# EAGLE schematic Tally Board (EAGLE 6.2)
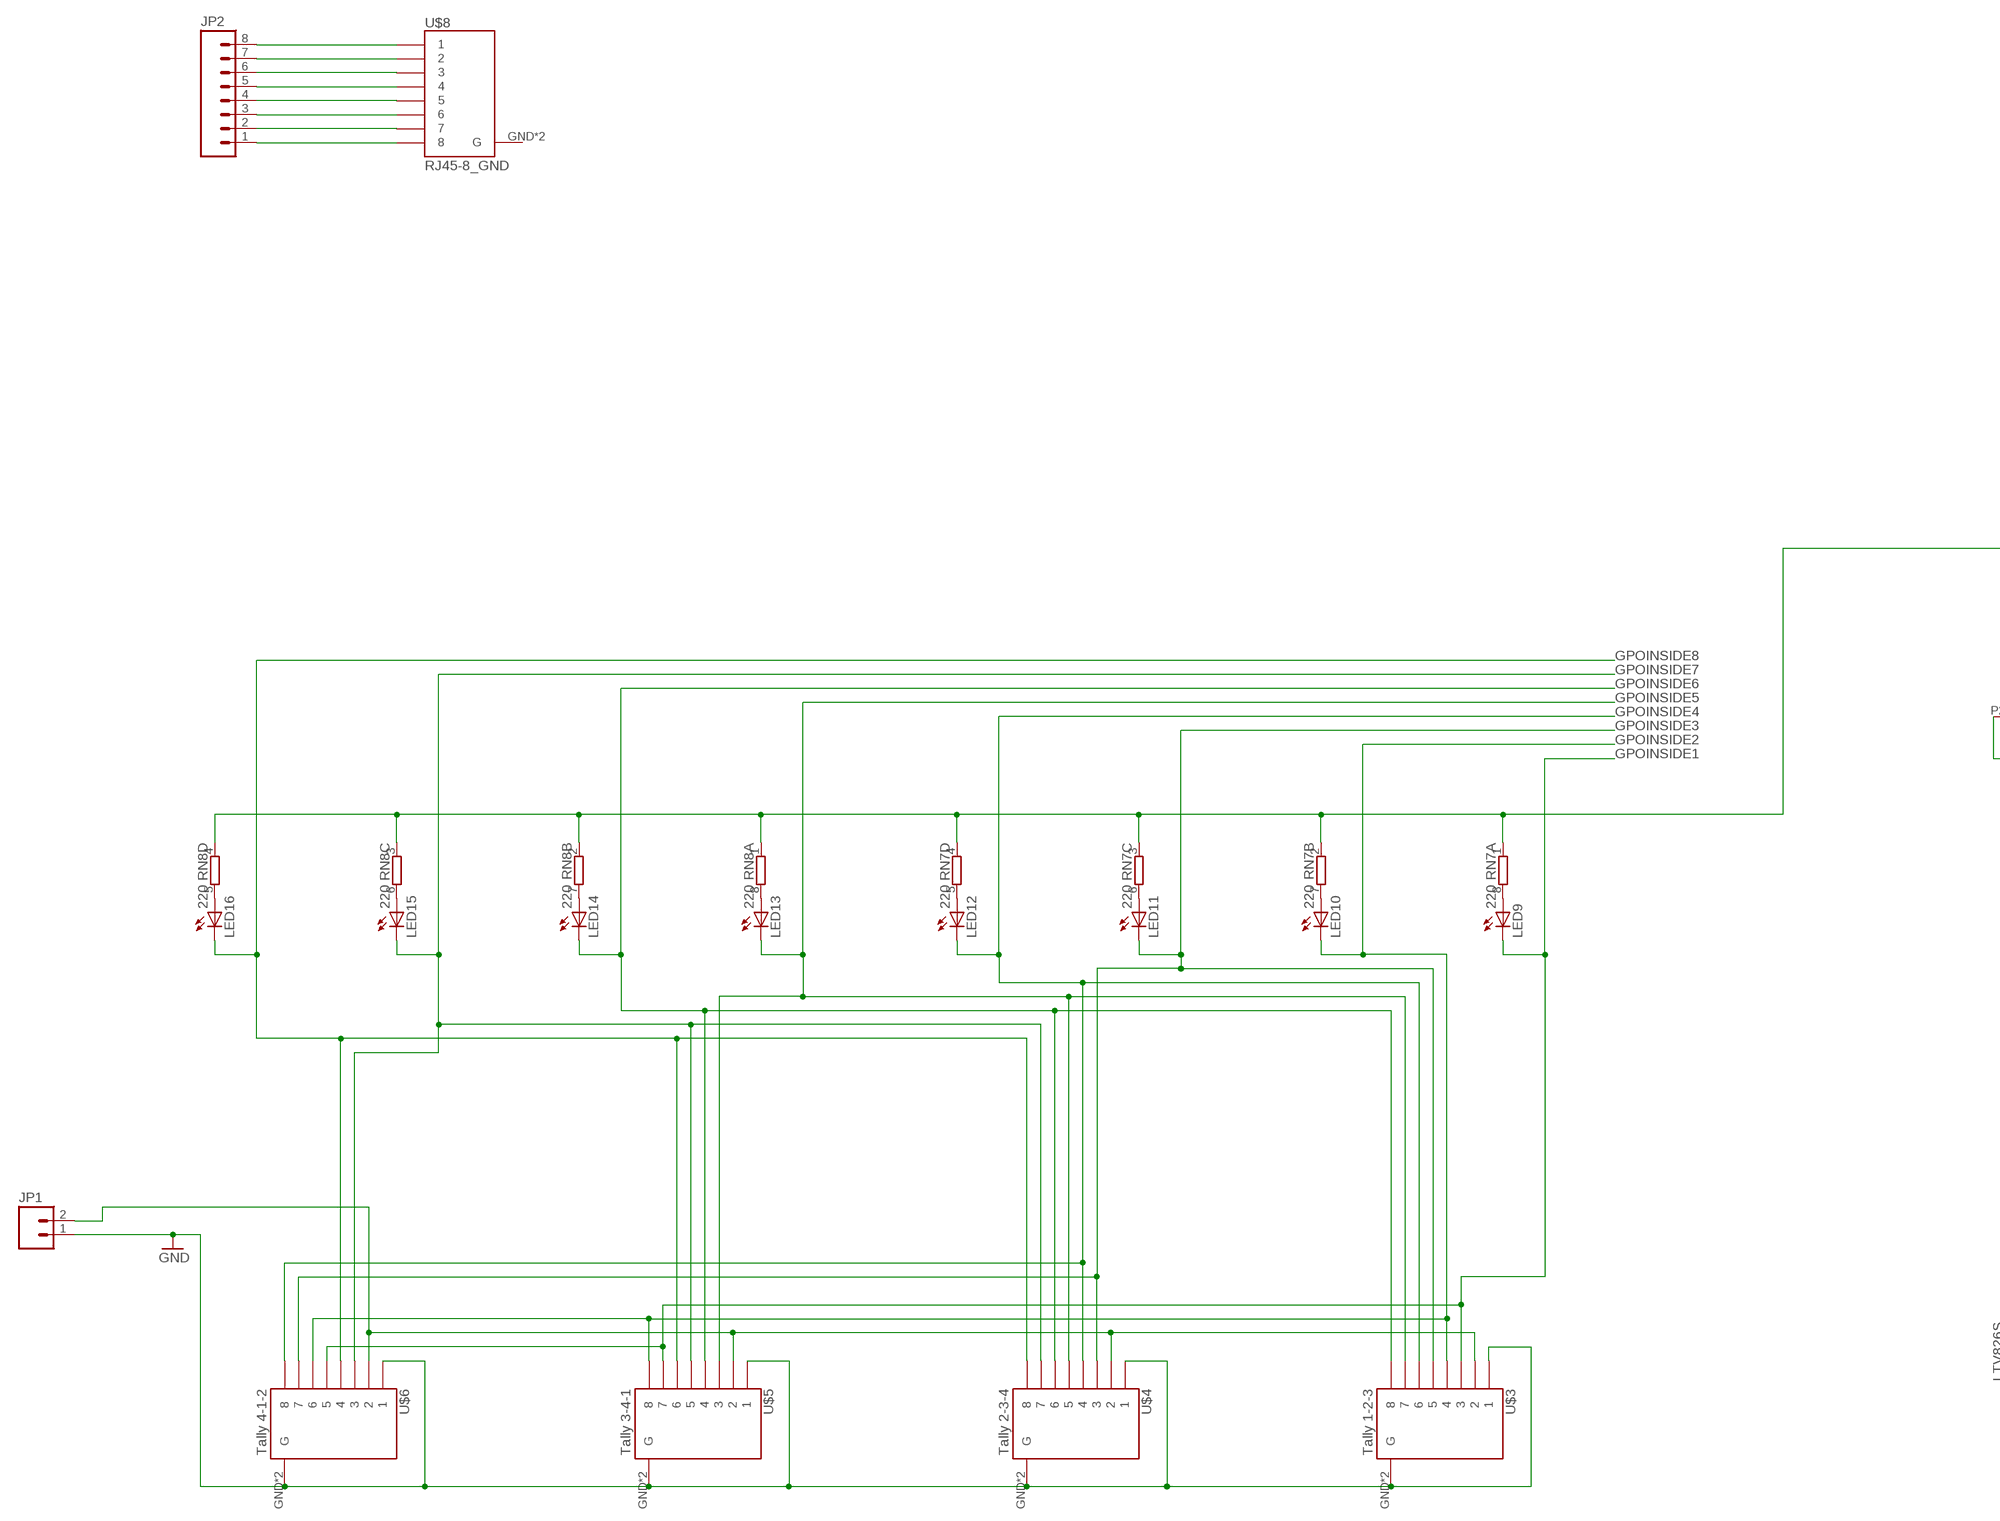
[diagram p0: schematic, sheet 1, part 1 of 2]
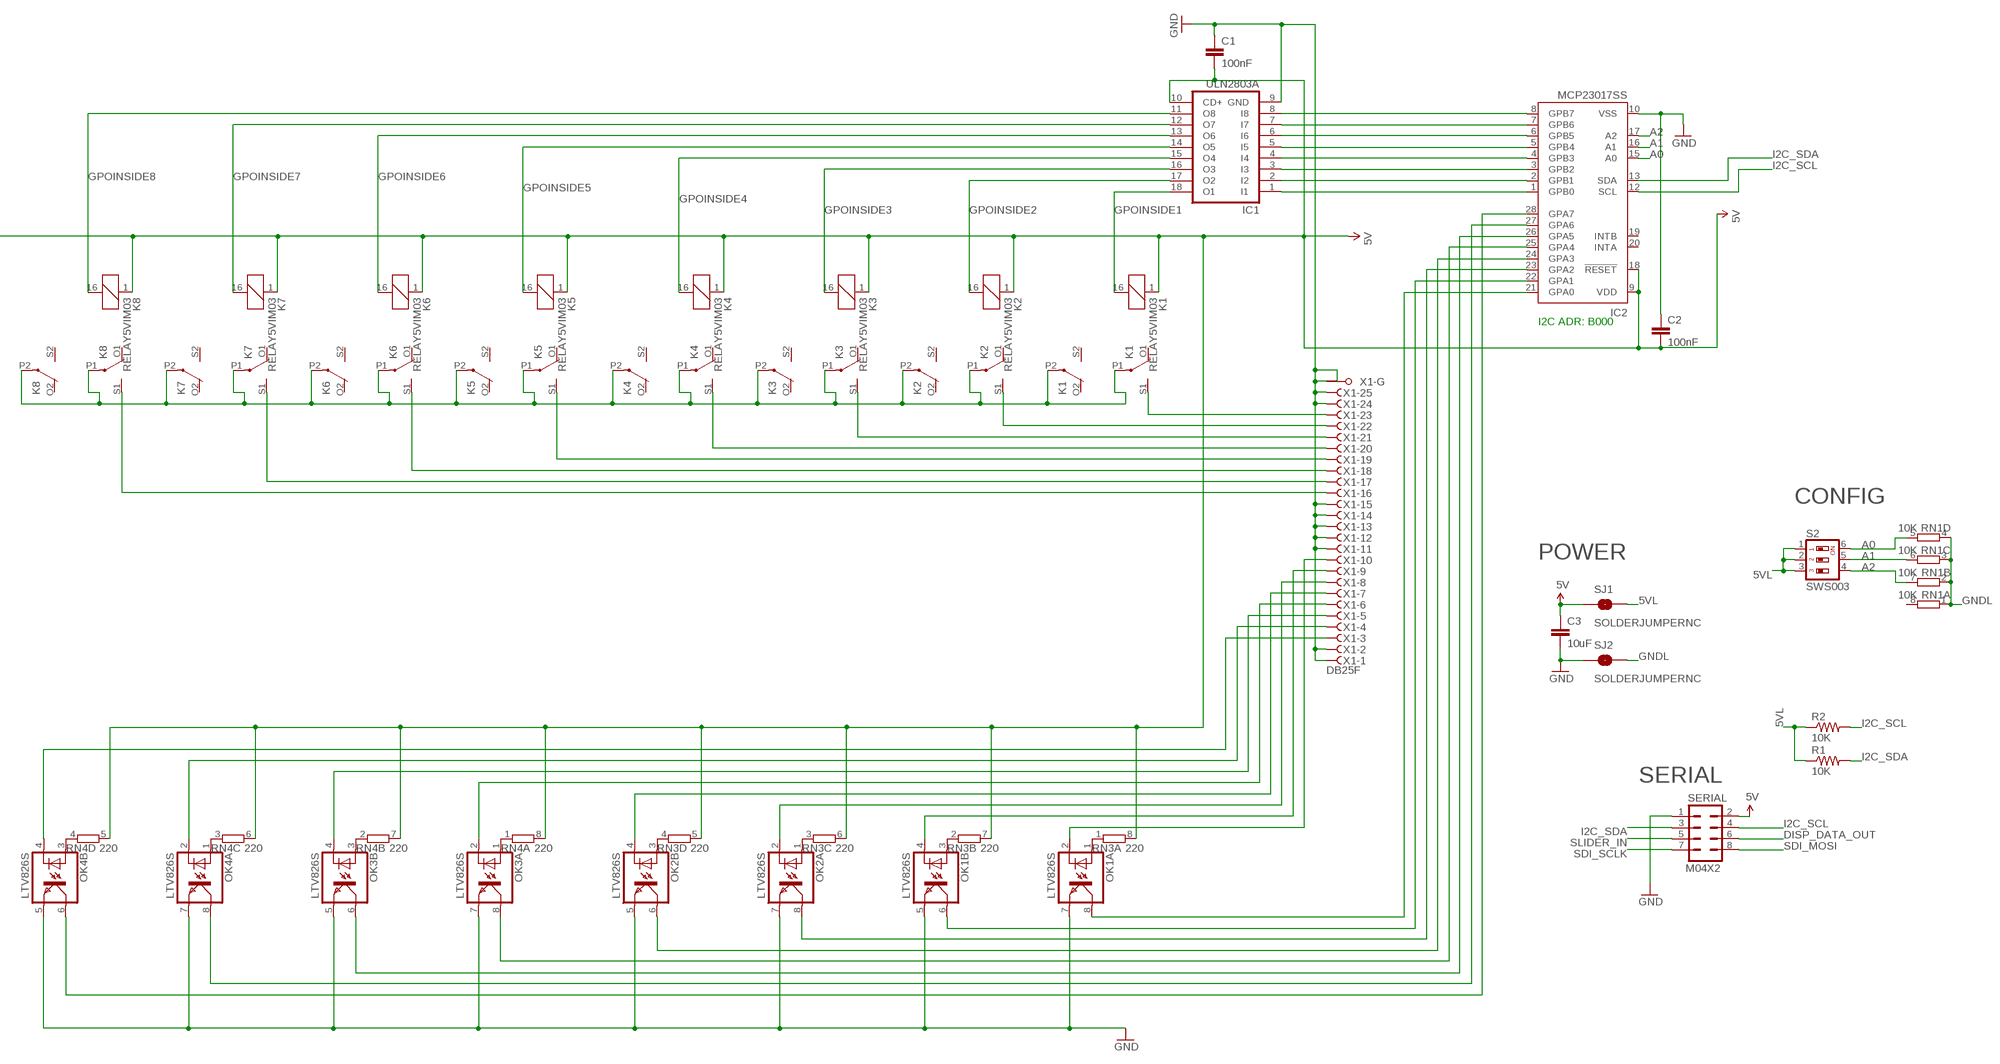
[diagram p1: schematic, sheet 1, part 2 of 2]

## Parts
C1  100nF  CAP0805  [0805]
C2  100nF  CAP0603-CAP  [0603-CAP]
C3  10uF  CAP0805  [0805]
IC1  ULN2803A  ULN2803ASO18W  [SO18W]
IC2  MCP23017SS  [SSOP28]
JP1  M02PTH4  [1X02_XTRA_BIG]
JP2  M081X08  [1X08]
K1  RELAY5VIM03  [DS2Y]
K2  RELAY5VIM03  [DS2Y]
K3  RELAY5VIM03  [DS2Y]
K4  RELAY5VIM03  [DS2Y]
K5  RELAY5VIM03  [DS2Y]
K6  RELAY5VIM03  [DS2Y]
K7  RELAY5VIM03  [DS2Y]
K8  RELAY5VIM03  [DS2Y]
LED9  LED3MM  [LED3MM]
LED10  LED3MM  [LED3MM]
LED11  LED3MM  [LED3MM]
LED12  LED3MM  [LED3MM]
LED13  LED3MM  [LED3MM]
LED14  LED3MM  [LED3MM]
LED15  LED3MM  [LED3MM]
LED16  LED3MM  [LED3MM]
OK1  LTV826S  [DIL8-SMD]
OK2  LTV826S  [DIL8-SMD]
OK3  LTV826S  [DIL8-SMD]
OK4  LTV826S  [DIL8-SMD]
R1  10K  RESISTOR0603-RES  [0603-RES]
R2  10K  RESISTOR0603-RES  [0603-RES]
RN1  10K  4R-NCAY16  [CAY16_HAND]
RN3  220  4R-NCAY16  [CAY16]
RN4  220  4R-NCAY16  [CAY16]
RN7  220  4R-NCAY16  [CAY16_HAND]
RN8  220  4R-NCAY16  [CAY16_HAND]
S2  SWS003  [SMS-003]
SERIAL  M04X2  [2X4]
SJ1  SOLDERJUMPERNC  [SJ_2S]
SJ2  SOLDERJUMPERNC  [SJ_2S]
U$3  Tally 1-2-3  RJ45-8_GND  [RJ45-8_GND]
U$4  Tally 2-3-4  RJ45-8_GND  [RJ45-8_GND]
U$5  Tally 3-4-1  RJ45-8_GND  [RJ45-8_GND]
U$6  Tally 4-1-2  RJ45-8_GND  [RJ45-8_GND]
U$8  RJ45-8_GND  [RJ45-8_GND]
X1  DB25F  F25HPS  [F25HP]

## Nets
5V [Power]: C1.2 C2.2 C3.1 IC1.10(CD+) IC2.9(VDD) IC2.18(!RESET) K1.1 K2.1 K3.1 K4.1 K5.1 K6.1 K7.1 K8.1 RN3.5 RN3.6 RN3.7 RN3.8 RN4.5 RN4.6 RN4.7 RN4.8 RN7.1 RN7.2 RN7.3 RN7.4 RN8.1 RN8.2 RN8.3 RN8.4 SERIAL.2 SJ1.1
5VL: R1.1 R2.1 S2.1 S2.2 S2.3 SJ1.2
A0: IC2.15(A0) RN1.5 S2.6
A1: IC2.16(A1) RN1.6 S2.5
A2: IC2.17(A2) RN1.7 S2.4
DISP_DATA_OUT: SERIAL.6
GND [Power]: C1.1 C2.1 C3.2 IC1.9(GND) IC2.10(VSS) JP1.1 OK1.5(B:EMIT) OK1.7(A:EMIT) OK2.5(B:EMIT) OK2.7(A:EMIT) OK3.5(B:EMIT) OK3.7(A:EMIT) OK4.5(B:EMIT) OK4.7(A:EMIT) SERIAL.1 SJ2.1 U$3.1 U$3.GND1(G) U$3.GND(G) U$4.1 U$4.GND1(G) U$4.GND(G) U$5.1 U$5.GND1(G) U$5.GND(G) U$6.1 U$6.GND1(G) U$6.GND(G) X1.1(-1:F) X1.2(-2:F) X1.11(-11:F) X1.12(-12:F) X1.13(-13:F) X1.14(-14:F) X1.15(-15:F) X1.24(-24:F) X1.25(-25:F) X1.G1(-G:G1) X1.G2(-G:G2)
GNDL: RN1.1 RN1.2 RN1.3 RN1.4 SJ2.2
GPOINSIDE1: IC1.18(O1) K1.16 LED9.K(C) U$3.3 U$5.7 U$6.5
GPOINSIDE2: IC1.17(O2) K2.16 LED10.K(C) U$3.4 U$5.8 U$6.6
GPOINSIDE3: IC1.16(O3) K3.16 LED11.K(C) U$3.5 U$4.3 U$6.7
GPOINSIDE4: IC1.15(O4) K4.16 LED12.K(C) U$3.6 U$4.4 U$6.8
GPOINSIDE5: IC1.14(O5) K5.16 LED13.K(C) U$3.7 U$4.5 U$5.3
GPOINSIDE6: IC1.13(O6) K6.16 LED14.K(C) U$3.8 U$4.6 U$5.4
GPOINSIDE7: IC1.12(O7) K7.16 LED15.K(C) U$4.7 U$5.5 U$6.3
GPOINSIDE8: IC1.11(O8) K8.16 LED16.K(C) U$4.8 U$5.6 U$6.4
I2C_SCL: IC2.12(SCL) R2.2 SERIAL.4
I2C_SDA: IC2.13(SDA) R1.2 SERIAL.3
N$1 [RELAY LINES]: K1.S1(2:S) X1.23(-23:F)
N$2: JP2.8 U$8.1
N$3: JP2.7 U$8.2
N$4: JP2.6 U$8.3
N$5: IC1.1(I1) IC2.1(GPB0)
N$6 [RELAY LINES]: K2.S1(2:S) X1.22(-22:F)
N$7: JP2.5 U$8.4
N$8: JP2.4 U$8.5
N$9: JP2.3 U$8.6
N$10 [RELAY LINES]: K3.S1(2:S) X1.21(-21:F)
N$11: JP2.2 U$8.7
N$12: JP2.1 U$8.8
N$14 [RELAY LINES]: K4.S1(2:S) X1.20(-20:F)
N$18 [RELAY LINES]: K5.S1(2:S) X1.19(-19:F)
N$22 [RELAY LINES]: K6.S1(2:S) X1.18(-18:F)
N$26 [RELAY LINES]: K7.S1(2:S) X1.17(-17:F)
N$27: LED9.A RN7.8
N$30 [RELAY LINES]: K8.S1(2:S) X1.16(-16:F)
N$31: LED10.A RN7.7
N$34: IC1.2(I2) IC2.2(GPB1)
N$35: IC1.3(I3) IC2.3(GPB2)
N$36: IC1.4(I4) IC2.4(GPB3)
N$37: IC1.5(I5) IC2.5(GPB4)
N$38: IC1.6(I6) IC2.6(GPB5)
N$39: IC1.7(I7) IC2.7(GPB6)
N$40: IC1.8(I8) IC2.8(GPB7)
N$49 [INput lines]: OK1.2(A:C) X1.10(-10:F)
N$50: OK1.1(A:A) RN3.1
N$51: IC2.21(GPA0) OK1.8(A:COL)
N$52: OK1.3(B:A) RN3.2
N$53: OK2.1(A:A) RN3.3
N$54: OK2.3(B:A) RN3.4
N$55 [INput lines]: OK3.2(A:C) X1.6(-6:F)
N$56: OK3.1(A:A) RN4.1
N$57: OK3.3(B:A) RN4.2
N$58: OK4.1(A:A) RN4.3
N$59: OK4.3(B:A) RN4.4
N$60 [INput lines]: OK1.4(B:C) X1.9(-9:F)
N$61 [INput lines]: OK2.2(A:C) X1.8(-8:F)
N$62 [INput lines]: OK2.4(B:C) X1.7(-7:F)
N$63: IC2.28(GPA7) OK4.6(B:COL)
N$64 [INput lines]: OK3.4(B:C) X1.5(-5:F)
N$65 [INput lines]: OK4.2(A:C) X1.4(-4:F)
N$66 [INput lines]: OK4.4(B:C) X1.3(-3:F)
N$68: IC2.22(GPA1) OK1.6(B:COL)
N$69: IC2.23(GPA2) OK2.8(A:COL)
N$70: IC2.24(GPA3) OK2.6(B:COL)
N$71: IC2.25(GPA4) OK3.8(A:COL)
N$72: IC2.26(GPA5) OK3.6(B:COL)
N$73: IC2.27(GPA6) OK4.8(A:COL)
N$76: LED11.A RN7.6
N$77: LED12.A RN7.5
N$78: LED13.A RN8.8
N$79: LED14.A RN8.7
N$80: LED15.A RN8.6
N$81: LED16.A RN8.5
N$82: JP1.2 U$3.2 U$4.2 U$5.2 U$6.2
N$85 [Power]: K1.P1(2:P) K1.P2(3:P) K2.P1(2:P) K2.P2(3:P) K3.P1(2:P) K3.P2(3:P) K4.P1(2:P) K4.P2(3:P) K5.P1(2:P) K5.P2(3:P) K6.P1(2:P) K6.P2(3:P) K7.P1(2:P) K7.P2(3:P) K8.P1(2:P) K8.P2(3:P)
SDI_MOSI: SERIAL.8
SDI_SCLK: SERIAL.7
SLIDER_IN: SERIAL.5
Unconnected: IC2.19(INTB) IC2.20(INTA) K1.O1(2:O) K1.O2(3:O) K1.S2(3:S) K2.O1(2:O) K2.O2(3:O) K2.S2(3:S) K3.O1(2:O) K3.O2(3:O) K3.S2(3:S) K4.O1(2:O) K4.O2(3:O) K4.S2(3:S) K5.O1(2:O) K5.O2(3:O) K5.S2(3:S) K6.O1(2:O) K6.O2(3:O) K6.S2(3:S) K7.O1(2:O) K7.O2(3:O) K7.S2(3:S) K8.O1(2:O) K8.O2(3:O) K8.S2(3:S) RN1.8

## Notes on the sheet
- I2C ADR: B000
- CONFIG
- POWER
- SERIAL

## Power pins joined to a net without a drawn wire
G: U$8.GND1(G) U$8.GND(G)

## Library data of the parts
C1-C3 = SparkFun:CAP: Capacitor Standard 0603 ceramic capacitor, and 0.1" leaded capacitor.
IC1 = uln-udn:ULN2803A: DRIVER ARRAY
IC2 = microchip:MCP23017: http://ww1.microchip.com/downloads/en/DeviceDoc/21952a.pdf Source: http://ww1.microchip.com/downloads/en/DeviceDoc/21952a.pdf; MF: MICROCHIP; MPN: MCP23017-E/SS; OC_FARNELL: 1467674; OC_NEWARK: 31K2960
JP1 = SparkFun:M02: Header 2 Standard 2-pin 0.1" header. Use with straight break away headers (SKU : PRT-00116), right angle break away headers (PRT-00553), swiss pins (PRT-00743), machine pins (PRT-00117), and female headers (PRT-00115). Molex polarized connector foot print use with SKU : PRT-08233 with associated crimp pins and housings.
JP2 = SKAARHOJ:M08: Header 8 Standard 8-pin 0.1" header. Use with straight break away headers (SKU : PRT-00116), right angle break away headers (PRT-00553), swiss pins (PRT-00743), machine pins (PRT-00117), and female headers (PRT-00115).
K1-K8 = SKAARHOJ:RELAY5V: RELAY 2 x switch, AxiCom 150 mW 5V
LED9-LED16 = led:LED: LED OSRAM: - CHIPLED LG R971, LG N971, LY N971, LG Q971, LY Q971, LO R971, LY R971 LH N974, LH R974 LS Q976, LO Q976, LY Q976 LO Q996 - Hyper CHIPLED LW Q18S LB Q993, LB Q99A, LB R99A - SideLED LS A670, LO A670, LY A670, LG A670, LP A670 LB A673, LV A673, LT A673, LW A673 LH A674 LY A675 LS A676, LA A676, LO A676, LY A676, LW A676 LS A679, LY A679, LG A679 - Hyper Micro SIDELED® LS Y876, LA Y876, LO Y876, LY Y876 LT Y87S - SmartLED LW L88C, LW L88S LB L89C, LB L89S, LG L890 LS L89K, LO L89K, LY L89K LS L896, LA L896, LO L896, LY L896 - TOPLED LS T670, LO T670, LY T670, LG T670, LP T670 LSG T670, LSP T670, LSY T670, LOP T670, LYG T670 LG T671, LOG T671, LSG T671 LB T673, LV T673, LT T673, LW T673 LH T674 LS T676, LA T676, LO T676, LY T676, LB T676, LH T676, LSB T676, LW T676 LB T67C, LV T67C, LT T67C, LS T67K, LO T67K, LY T67K, LW E67C LS E67B, LA E67B, LO E67B, LY E67B, LB E67C, LV E67C, LT E67C LW T67C LS T679, LY T679, LG T679 LS T770, LO T770, LY T770, LG T770, LP T770 LB T773, LV T773, LT T773, LW T773 LH T774 LS E675, LA E675, LY E675, LS T675 LS T776, LA T776, LO T776, LY T776, LB T776 LHGB T686 LT T68C, LB T68C - Hyper Mini TOPLED® LB M676 - Mini TOPLED Santana® LG M470 LS M47K, LO M47K, LY M47K Source: http://www.osram.convergy.de LUXEON: - LUMILED® LXK2-PW12-R00, LXK2-PW12-S00, LXK2-PW14-U00, LXK2-PW14-V00 LXK2-PM12-R00, LXK2-PM12-S00, LXK2-PM14-U00 LXK2-PE12-Q00, LXK2-PE12-R00, LXK2-PE12-S00, LXK2-PE14-T00, LXK2-PE14-U00 LXK2-PB12-K00, LXK2-PB12-L00, LXK2-PB12-M00, LXK2-PB14-N00, LXK2-PB14-P00, LXK2-PB14-Q00 LXK2-PR12-L00, LXK2-PR12-M00, LXK2-PR14-Q00, LXK2-PR14-R00 LXK2-PD12-Q00, LXK2-PD12-R00, LXK2-PD12-S00 LXK2-PH12-R00, LXK2-PH12-S00 LXK2-PL12-P00, LXK2-PL12-Q00, LXK2-PL12-R00 Source: www.luxeon.com KINGBRIGHT: KA-3528ASYC Source: www.kingbright.com
OK1-OK4 = optocoupler:LTV826: OPTO COUPLER Source: LITEON, LTV816.pdf; OC_FARNELL: unknown; OC_NEWARK: unknown
R1 R2 = SparkFun:RESISTOR: Resistor Basic schematic elements and footprints for 0603, 1206, and PTH resistors.
RN1 RN7 RN8 = SKAARHOJ:4R-N: Array Chip Resistor Source: RS Component / Phycomp; OC_FARNELL: unknown; OC_NEWARK: unknown
RN3 RN4 = resistor-dil:4R-N: Array Chip Resistor Source: RS Component / Phycomp; OC_FARNELL: unknown; OC_NEWARK: unknown
S2 = smd-special:SWS003: SMD Dip Switch 3 pol.
SERIAL = SparkFun:M04X2
SJ1 SJ2 = SparkFun:SOLDERJUMPER: Solder Jumper Standard SMD solder jumper. Used to automate production. Two varients : Normally Open and Normally Closed are the same, but have different paste layers. NC will have a large amount of paste and should jumper during reflow.
U$3-U$6 U$8 = SKAARHOJ:RJ45-8_GND
X1 = con-subd:F25HPS: SUB-D; OC_FARNELL: unknown; OC_NEWARK: unknown

## Net classes
0 default: width 0.203 mm, drill 0.406 mm, clearance 0.203 mm
1 Power: width 0.406 mm, drill 0.61 mm, clearance 0.203 mm
2 RELAY LINES: width 0.305 mm, clearance 0.254 mm
3 INput lines: clearance 0.254 mm